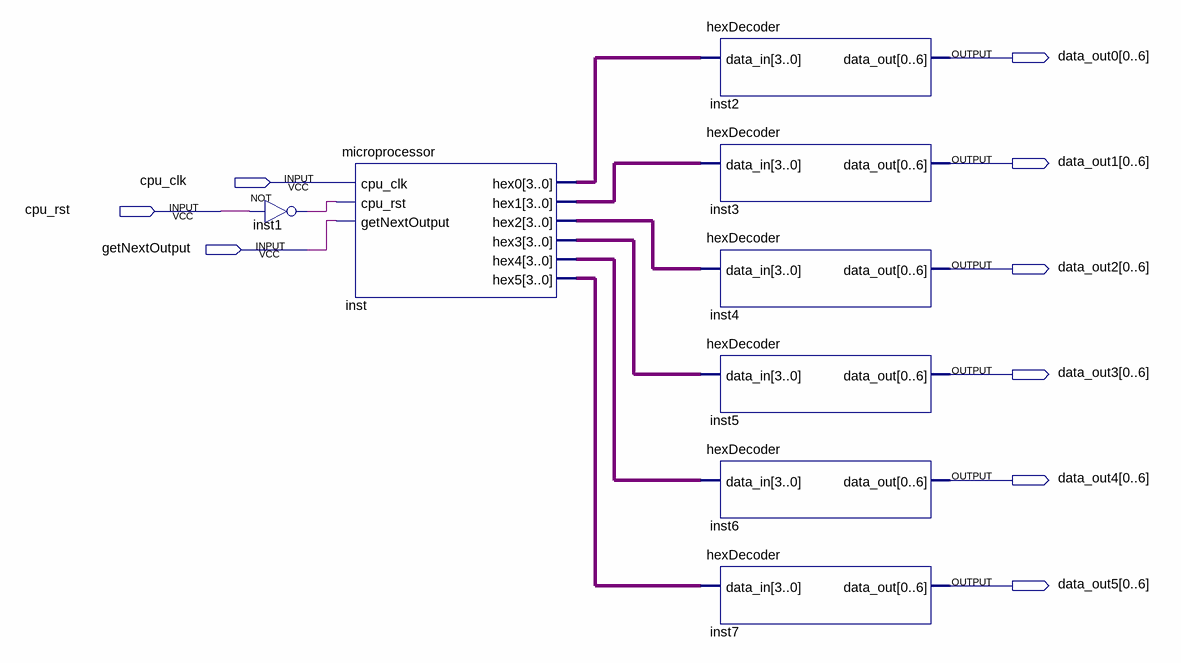
[diagram p0: schematic sheet]
// Quartus schematic microprocessorBDF.bdf as structural Verilog: 8 symbols, 9 pins
module microprocessorBDF (
  input  cpu_clk,
  input  cpu_rst,
  input  getNextOutput,
  output [0:6] data_out0,
  output [0:6] data_out1,
  output [0:6] data_out2,
  output [0:6] data_out3,
  output [0:6] data_out4,
  output [0:6] data_out5
);

  wire inst1_out;
  wire [3:0] inst_hex0, inst_hex1, inst_hex2, inst_hex3, inst_hex4, inst_hex5;

  not inst1 (inst1_out, cpu_rst);
  microprocessor inst (
    .cpu_clk(cpu_clk), .cpu_rst(inst1_out), .getNextOutput(getNextOutput), .hex0(inst_hex0),
    .hex1(inst_hex1), .hex2(inst_hex2), .hex3(inst_hex3), .hex4(inst_hex4), .hex5(inst_hex5));
  hexDecoder inst2 (.data_in(inst_hex0), .data_out(data_out0));
  hexDecoder inst3 (.data_in(inst_hex1), .data_out(data_out1));
  hexDecoder inst4 (.data_in(inst_hex2), .data_out(data_out2));
  hexDecoder inst5 (.data_in(inst_hex3), .data_out(data_out3));
  hexDecoder inst6 (.data_in(inst_hex4), .data_out(data_out4));
  hexDecoder inst7 (.data_in(inst_hex5), .data_out(data_out5));
endmodule
